# EAGLE design PowerBoard (EAGLE 7.5.0)
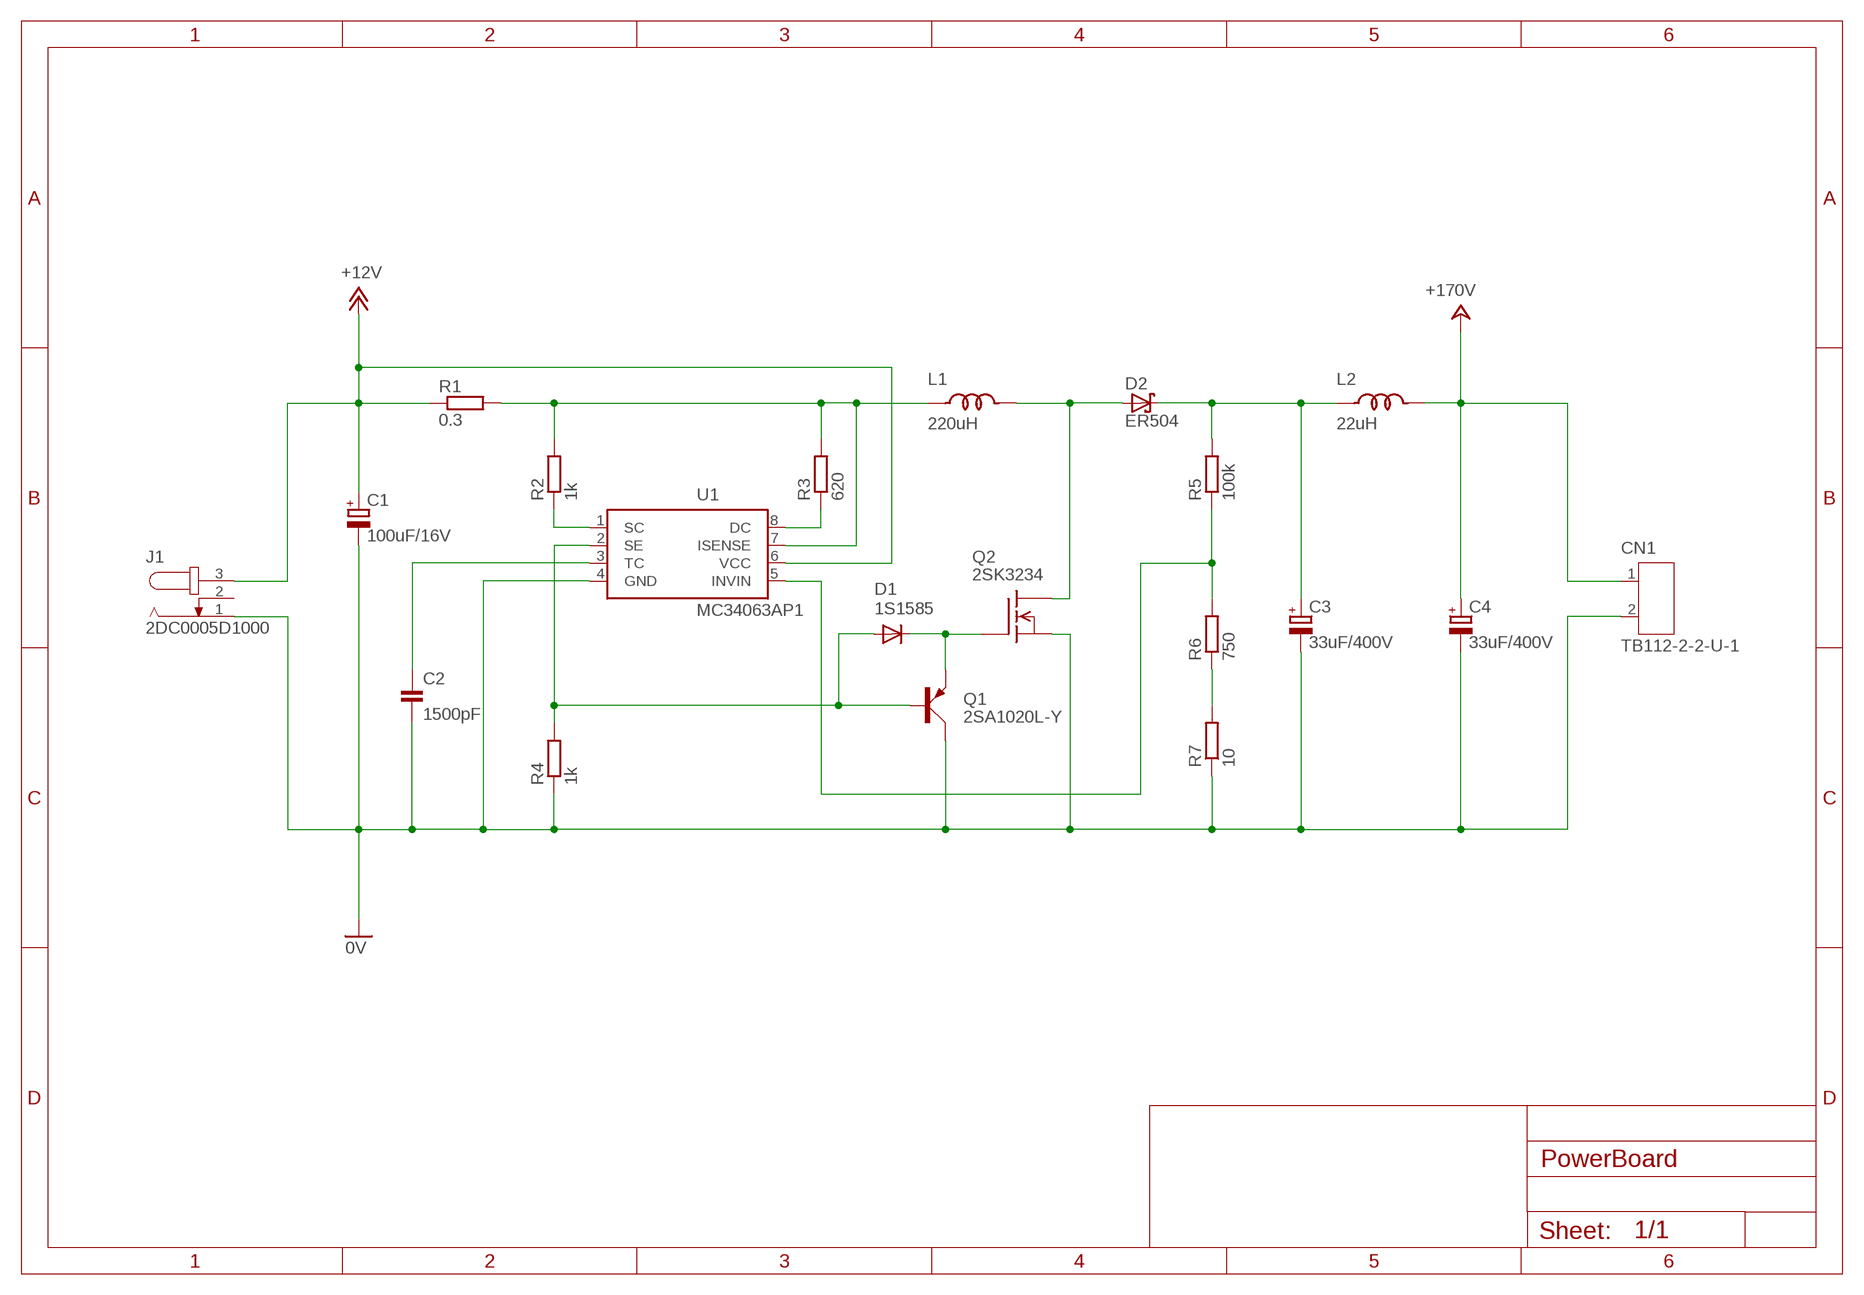
[diagram p0: schematic, sheet 1]

## Parts
C1  100uF/16V  ELECAP_200MIL  [ELECAP_200MIL]
C2  1500pF  CAP_200MIL  [CAP_200MIL]
C3  33uF/400V  ELECAP_300MIL  [ELECAP_300MIL]
C4  33uF/400V  ELECAP_300MIL  [ELECAP_300MIL]
CN1  TB112-2-2-U-1  [TERMINAL_BLOCK_2PIN_200MIL]
D1  1S1585  [DIODE-200MIL]
D2  ER504  [DIODE-500MIL]
J1  2DC0005D1000  [DCJACK_2.1_5.5]
L1  220uH  TC5026-220UH-050  [TOROID_COIL-300MIL]
L2  22uH  TC5026-22UH-060  [TOROID_COIL-300MIL]
Q1  2SA1020L-Y  [TO-92NL]
Q2  2SK3234  [TO-220]
R1  0.3  RESISTOR_600MIL  [RESISTOR_0411_600MIL]
R2  1k  RESISTOR_600MIL  [RESISTOR_0411_600MIL]
R3  620  RESISTOR_600MIL  [RESISTOR_0411_600MIL]
R4  1k  RESISTOR_600MIL  [RESISTOR_0411_600MIL]
R5  100k  RESISTOR_600MIL  [RESISTOR_0411_600MIL]
R6  750  RESISTOR_600MIL  [RESISTOR_0411_600MIL]
R7  10  RESISTOR_600MIL  [RESISTOR_0411_600MIL]
U1  MC34063AP1  [DIL08]

## Nets
0V: C1.- C2.2 C3.- C4.- CN1.2 J1.1 Q1.2(C) Q2.3(S) R4.1 R7.1 U1.4(GND)
+12V: C1.+ J1.3 R1.1 U1.6(VCC)
+24V: C4.+ CN1.1 L2.2 ; supply symbol labelled +170V
N$1: R3.1 U1.8(DC)
N$2: C3.+ D2.C L2.1 R5.2
N$3: C2.1 U1.3(TC)
N$4: R2.1 U1.1(SC)
N$5: L1.1 R1.2 R2.2 R3.2 U1.7(ISENSE)
N$6: R5.1 R6.2 U1.5(INVIN)
N$7: D1.A Q1.3(B) R4.2 U1.2(SE)
N$8: D1.C Q1.1(E) Q2.1(G)
N$9: R6.1 R7.2
N$10: D2.A L1.2 Q2.2(D)
Unconnected: J1.2

## Library data of the parts
C1 C3 C4 = Parts:ELECAP: 電解コンデンサー
C2 = Parts:CAP: コンデンサー
CN1 = Connectors:TB112-2-2-U-1: ターミナルブロック ２ピン ■ユニバーサル基板に挿せる汎用端子台 ■２ピンタイプ ■複数個連結が可能 ■寸法：９．０ｘ１０．６ｘ１２．３ｍｍ ■最大寸法：９．０ｘ１０．８ｘ１７．１ｍｍ 足の直径は約１．０ｍｍ
D1 = Parts:1S1585: 汎用小信号ダイオード ◆電気的特性 ・順電圧（ＶF）：１．０Ｖ＠ＩF＝１００ｍＡ ・逆電流（ＩR）：０．５μＡ＠ＶR＝８０Ｖ ・端子間容量ＣT）：２ｐＦ＠ＶR＝０Ｖ、１ＭＨｚ ・逆回復時間(ｔrr)：２ｎＳ＠ＶR＝６Ｖ、ＩF＝１０ｍＡ、ＲL＝１００Ω
D2 = Parts:ER504: ファストリカバリ・ダイオード ・耐圧：４００Ｖ ・電流：５Ａ ・ＶＦ：１．２５Ｖ（＠５Ａ） ・Ｉｒ：５μＡ（＠２５℃） ・回復時間（Ｔｒｒ）：３５ｎｓ ・接合容量：６５ｐＦ
J1 = Connectors:2DC0005D100: ２．１ｍｍ標準ＤＣジャック（４Ａ） 内径２．１ｍｍ外径５．５ｍｍ ＭＪ－１７９Ｐ（マル信無線電機）と同一形状です. SINGATRON ENTERPRISE CO., LTD 2DC0005D100 http://akizukidenshi.com/catalog/g/gC-01604/; OC_FARNELL: unknown; OC_NEWARK: unknown
L1 = Parts:TC5026-220UH-050: 電力用インダクタ 公称インダクタンス：220μH±10％ （＠1KHz/0.25V） 定格電流：5A 寸法：φD=15、H=7、φd=0.5、L=10（単位：mm）
L2 = Parts:TC5026-22UH-060: 電力用インダクタ 公称インダクタンス：22μH±10％ （＠1KHz/0.25V） 直流抵抗：650mΩ 定格電流：6A 寸法：φD=15、H=6.5、φd=0.6、L=8（単位：mm）
Q1 = Parts:2SA1020L: シリコンＰＮＰエピタキシャルトランジスタ ・ＶＣＢＯ：－５０Ｖ ・ＶＣＥＯ：－５０Ｖ ・ＶＥＢＯ：－５Ｖ ・ＩＣ：－２Ａ ・ＰＣ：９００ｍＷ（ＴＡ＝２５℃） ・パッケージ：ＴＯ－９２（ＥＣＢ）
Q2 = Parts:2SK3234: Ｎチャンネル高耐圧パワーＭＯＳＦＥＴ ■電源，ＤＣ－ＤＣコンバータ向け ・耐圧（ＶＤＳＳ）：５００Ｖ ・ＩＤ＝８Ａ ・低オン抵抗：ＲＤＳ＝０．６５Ω ・スイッチングスピード：ｔｆ＝２５ｎｓ
R1-R7 = Parts:RESISTOR: 抵抗器
U1 = Parts:MC34063A*: DC/DCスイッチングレギュレータ ■生産中止品 ■スイッチ電流: 1.5A (MAX) ■発振周波数: 100kHz ■過電流検出回路内蔵 ■電源電圧: 3V~40V ■出力電圧 :1.25V~40V ■動作温度 : 0°C～70°C

## Board
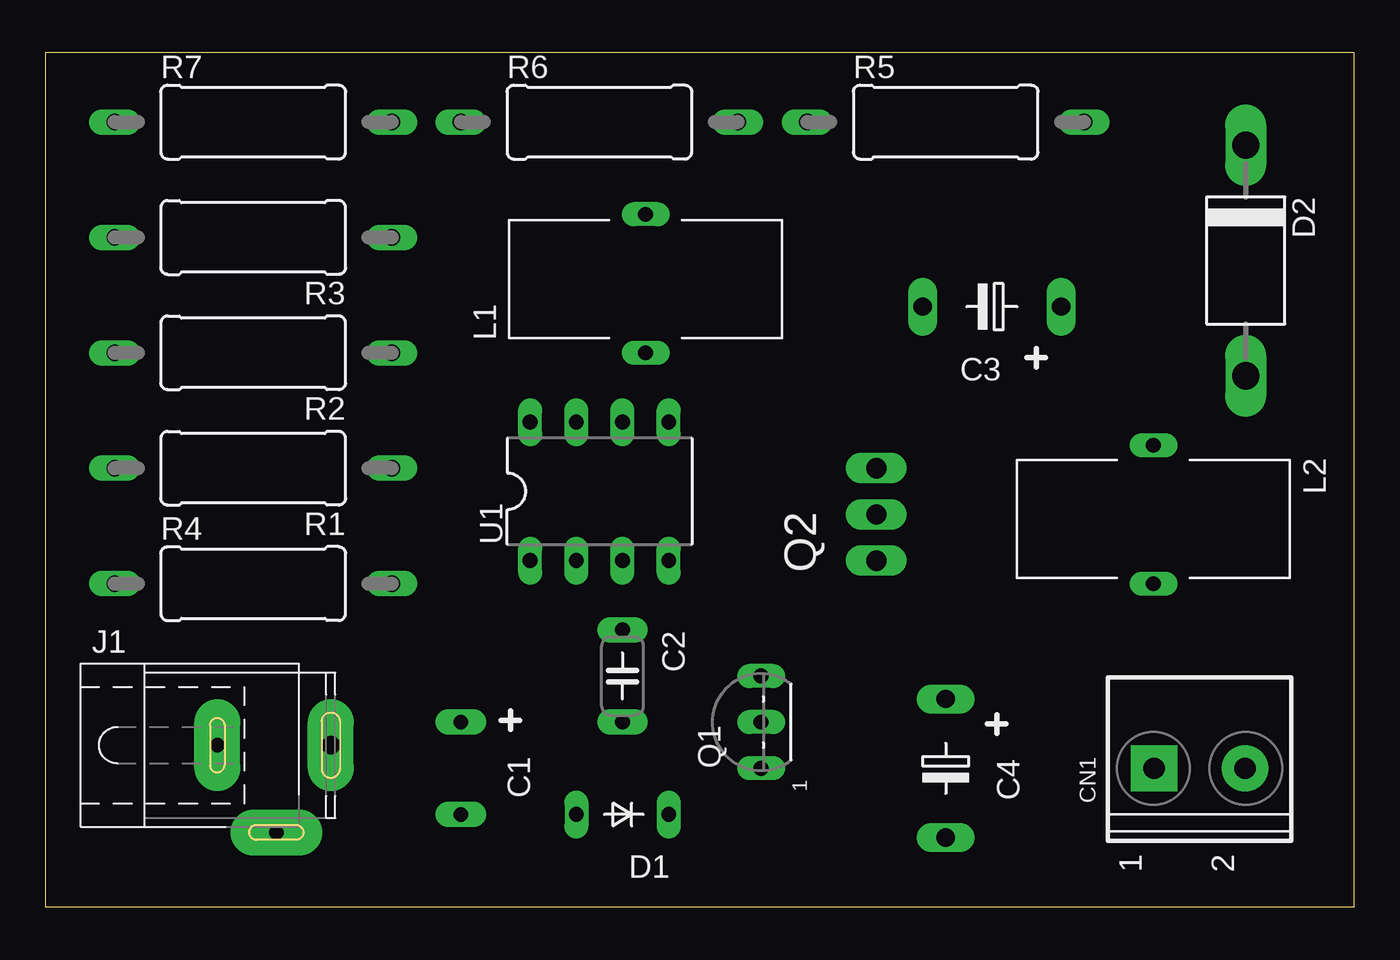
[diagram p1: board, top side]
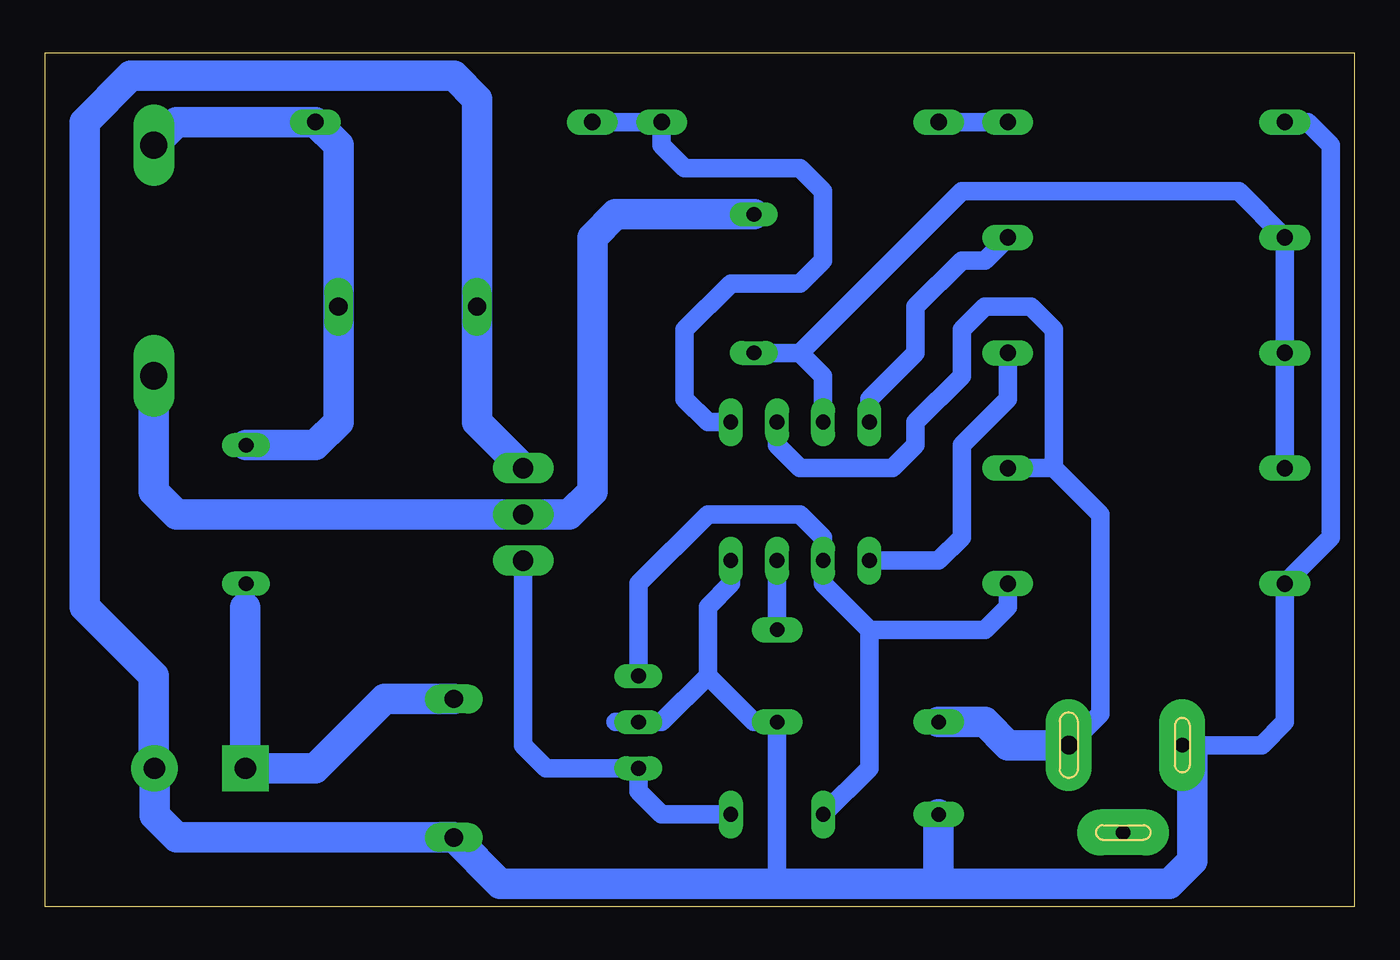
[diagram p2: board, bottom side, seen from below]

Size 72 x 47 mm. Coordinates in mm from the lower left corner, seen from the top.
Outline: 0,0 72,0 72,47 0,47 0,0
Copper layers (1*16): Top 0.035mm / dielectric 1.5mm / Bottom 0.035mm
Design rules "SeeedStudio_2layer_DRU_no_angle_20140221": minimum track width 6mil, minimum drill 12mil, track to track 6mil, track to pad 6mil, pad to pad 6mil, via to via 6mil, smd to smd 0mil, copper to edge 10mil, drill to drill 10mil, minimum pad ring 10mil, minimum via ring 6mil, stop-mask expansion 2mil, vias tented up to drill 100mil, thermal gap 10mil

### Footprints (pad centres in the part's own frame; a part is rotated, then mirrored left to right if it is on the bottom)
ELECAP_200MIL = drill 0.8 pad 1.4 long: + -1.27,0; - 3.81,0
CAP_200MIL = drill 0.8 pad 1.4 long: 1 -2.54,0; 2 2.54,0
ELECAP_300MIL = drill 1 pad 1.6 long: + -3.81,0; - 3.81,0
TERMINAL_BLOCK_2PIN_200MIL = drill 1.168 pad 2.54 square: 1 0,-0.04 | drill 1.168 pad 2.54: 2 0,-5.04
DIODE-200MIL = drill 0.813 long: A 2.54,0; C -2.54,0
DIODE-500MIL = drill 1.5 long: A 12.7,0; C 0,0
DCJACK_2.1_5.5 = drill 0.8 pad 2.54 long: 1 -3.25,0; 2 0,-4.8 | drill 1 pad 2.54 long: 3 3,0
TOROID_COIL-300MIL = drill 0.813 long: 1 -3.81,0; 2 3.81,0
TO-92NL = drill 0.813 long: 1 0,0; 2 2.54,0; 3 5.08,0
TO-220 = drill 1.118 long: 1 0,0; 2 2.54,0; 3 5.08,0
RESISTOR_0411_600MIL = drill 0.9 long: 1 -7.62,0; 2 7.62,0
DIL08 = drill 0.813 long: 1 -3.81,-3.81; 2 -1.27,-3.81; 3 1.27,-3.81; 4 3.81,-3.81; 5 3.81,3.81; 6 1.27,3.81; 7 -1.27,3.81; 8 -3.81,3.81

### Placement (x,y rotation side)
C1  22.86,8.89 270 top
C2  31.75,12.7 270 top
C3  52.07,33.02 180 top
C4  49.53,7.62 270 top
CN1  60.96,7.62 90 top
D1  31.75,5.08 180 top
D2  66.04,41.91 270 top
J1  12.7,8.89 0 top
L1  33.02,34.29 90 top
L2  60.96,21.59 270 top
Q1  39.37,7.62 90 top
Q2  45.72,19.05 90 top
R1  11.43,24.13 180 top
R2  11.43,30.48 180 top
R3  11.43,36.83 180 top
R4  11.43,17.78 0 top
R5  49.53,43.18 0 top
R6  30.48,43.18 0 top
R7  11.43,43.18 0 top
U1  30.48,22.86 0 top

### Tracks (layer width: path | path; a pad name or v marks a point on that pad's centre or on a via)
0V
  Bottom 1.016: R7.1 2.54,43.18 1.27,41.91 1.27,20.32 R4.1 3.81,10.16 5.08,8.89 J1.1 | 31.75,1.27 C2.2 33.02,10.16 35.56,12.7 | 66.04,7.62 CN1.2 | U1.4 34.29,17.78 35.56,16.51 35.56,12.7 | 35.56,12.7 38.1,10.16 Q1.2 40.64,10.16
  Bottom 1.676: 22.86,1.27 31.75,1.27 46.99,1.27 C4.- 64.77,3.81 66,5.04 CN1.2 66.04,7.66 66.04,12.7 69.85,16.51 69.85,43.18 67.31,45.72 49.53,45.72 48.26,44.45 48.26,34.29 C3.- 48.26,26.67 Q2.3 | 22.86,1.27 10.16,1.27 8.89,2.54 8.89,8.33 J1.1 | C1.- 22.86,1.27
+12V
  Bottom 1.016: R1.1 16.51,24.13 | 16.51,24.13 13.97,21.59 13.97,10.62 J1.3 | U1.6 31.75,25.4 30.48,24.13 25.4,24.13 24.13,25.4 24.13,26.67 21.59,29.21 21.59,31.75 20.32,33.02 17.78,33.02 16.51,31.75 16.51,24.13
  Bottom 1.676: J1.3 19.05,8.89 20.32,10.16 C1.+
+24V
  Bottom 1.016: 61,16.47 L2.2
  Bottom 1.676: 61,16.47 CN1.1 57.15,7.62 53.34,11.43 C4.+
N$1
  Bottom 1.016: U1.8 26.67,27.94 24.13,30.48 24.13,33.02 21.59,35.56 20.32,35.56 R3.1
N$2
  Bottom 1.676: D2.C 64.77,43.18 R5.2 55.88,41.91 C3.+ 55.88,26.67 57.15,25.4 L2.1
N$3
  Bottom 1.016: U1.3 C2.1
N$4
  Bottom 1.016: U1.1 22.86,19.05 21.59,20.32 21.59,25.4 19.05,27.94 R2.1
N$5
  Bottom 1.016: L1.1 30.48,30.48 | 30.48,30.48 29.21,29.21 U1.7 | R1.2 R2.2 R3.2 6.35,39.37 21.59,39.37 30.48,30.48
N$6
  Bottom 1.016: R5.1 R6.2 38.1,41.91 36.83,40.64 30.48,40.64 29.21,39.37 29.21,35.56 30.48,34.29 34.29,34.29 36.83,31.75 36.83,27.94 35.56,26.67 U1.5
N$7
  Bottom 1.016: R4.2 19.05,16.51 20.32,15.24 26.67,15.24 | 26.67,15.24 29.21,17.78 U1.2 29.21,20.32 30.48,21.59 35.56,21.59 39.37,17.78 Q1.3 | D1.A 26.67,7.62 26.67,15.24
N$8
  Bottom 1.016: D1.C 38.1,5.08 39.37,6.35 Q1.1 44.45,7.62 45.72,8.89 Q2.1
N$9
  Bottom 1.016: R6.1 R7.2
N$10
  Bottom 1.676: L1.2 40.64,38.1 41.91,36.83 41.91,22.86 43.18,21.59 Q2.2 64.77,21.59 66.04,22.86 D2.A